# Altium schematic sheet [2]-BLOCK_DIAGRAM.SchDoc
size A4
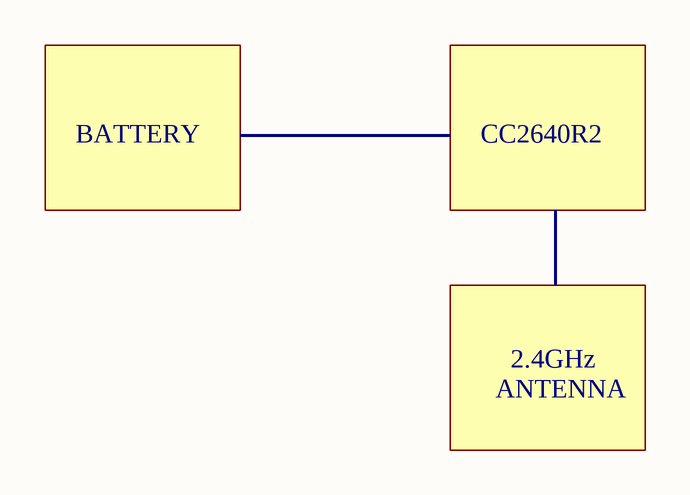
[diagram p0: [2]-BLOCK_DIAGRAM.SchDoc]

## Notes on the sheet
- BATTERY
- CC2640R2
- ANTENNA
- 2.4GHz